# EasyEDA schematic SCH_AirQuality.json
TITLE: ESP8266 Air Quality Sensor; REV: 1.0; Date: 2025-07-12; Sheet: 1/1; Company: Your Company
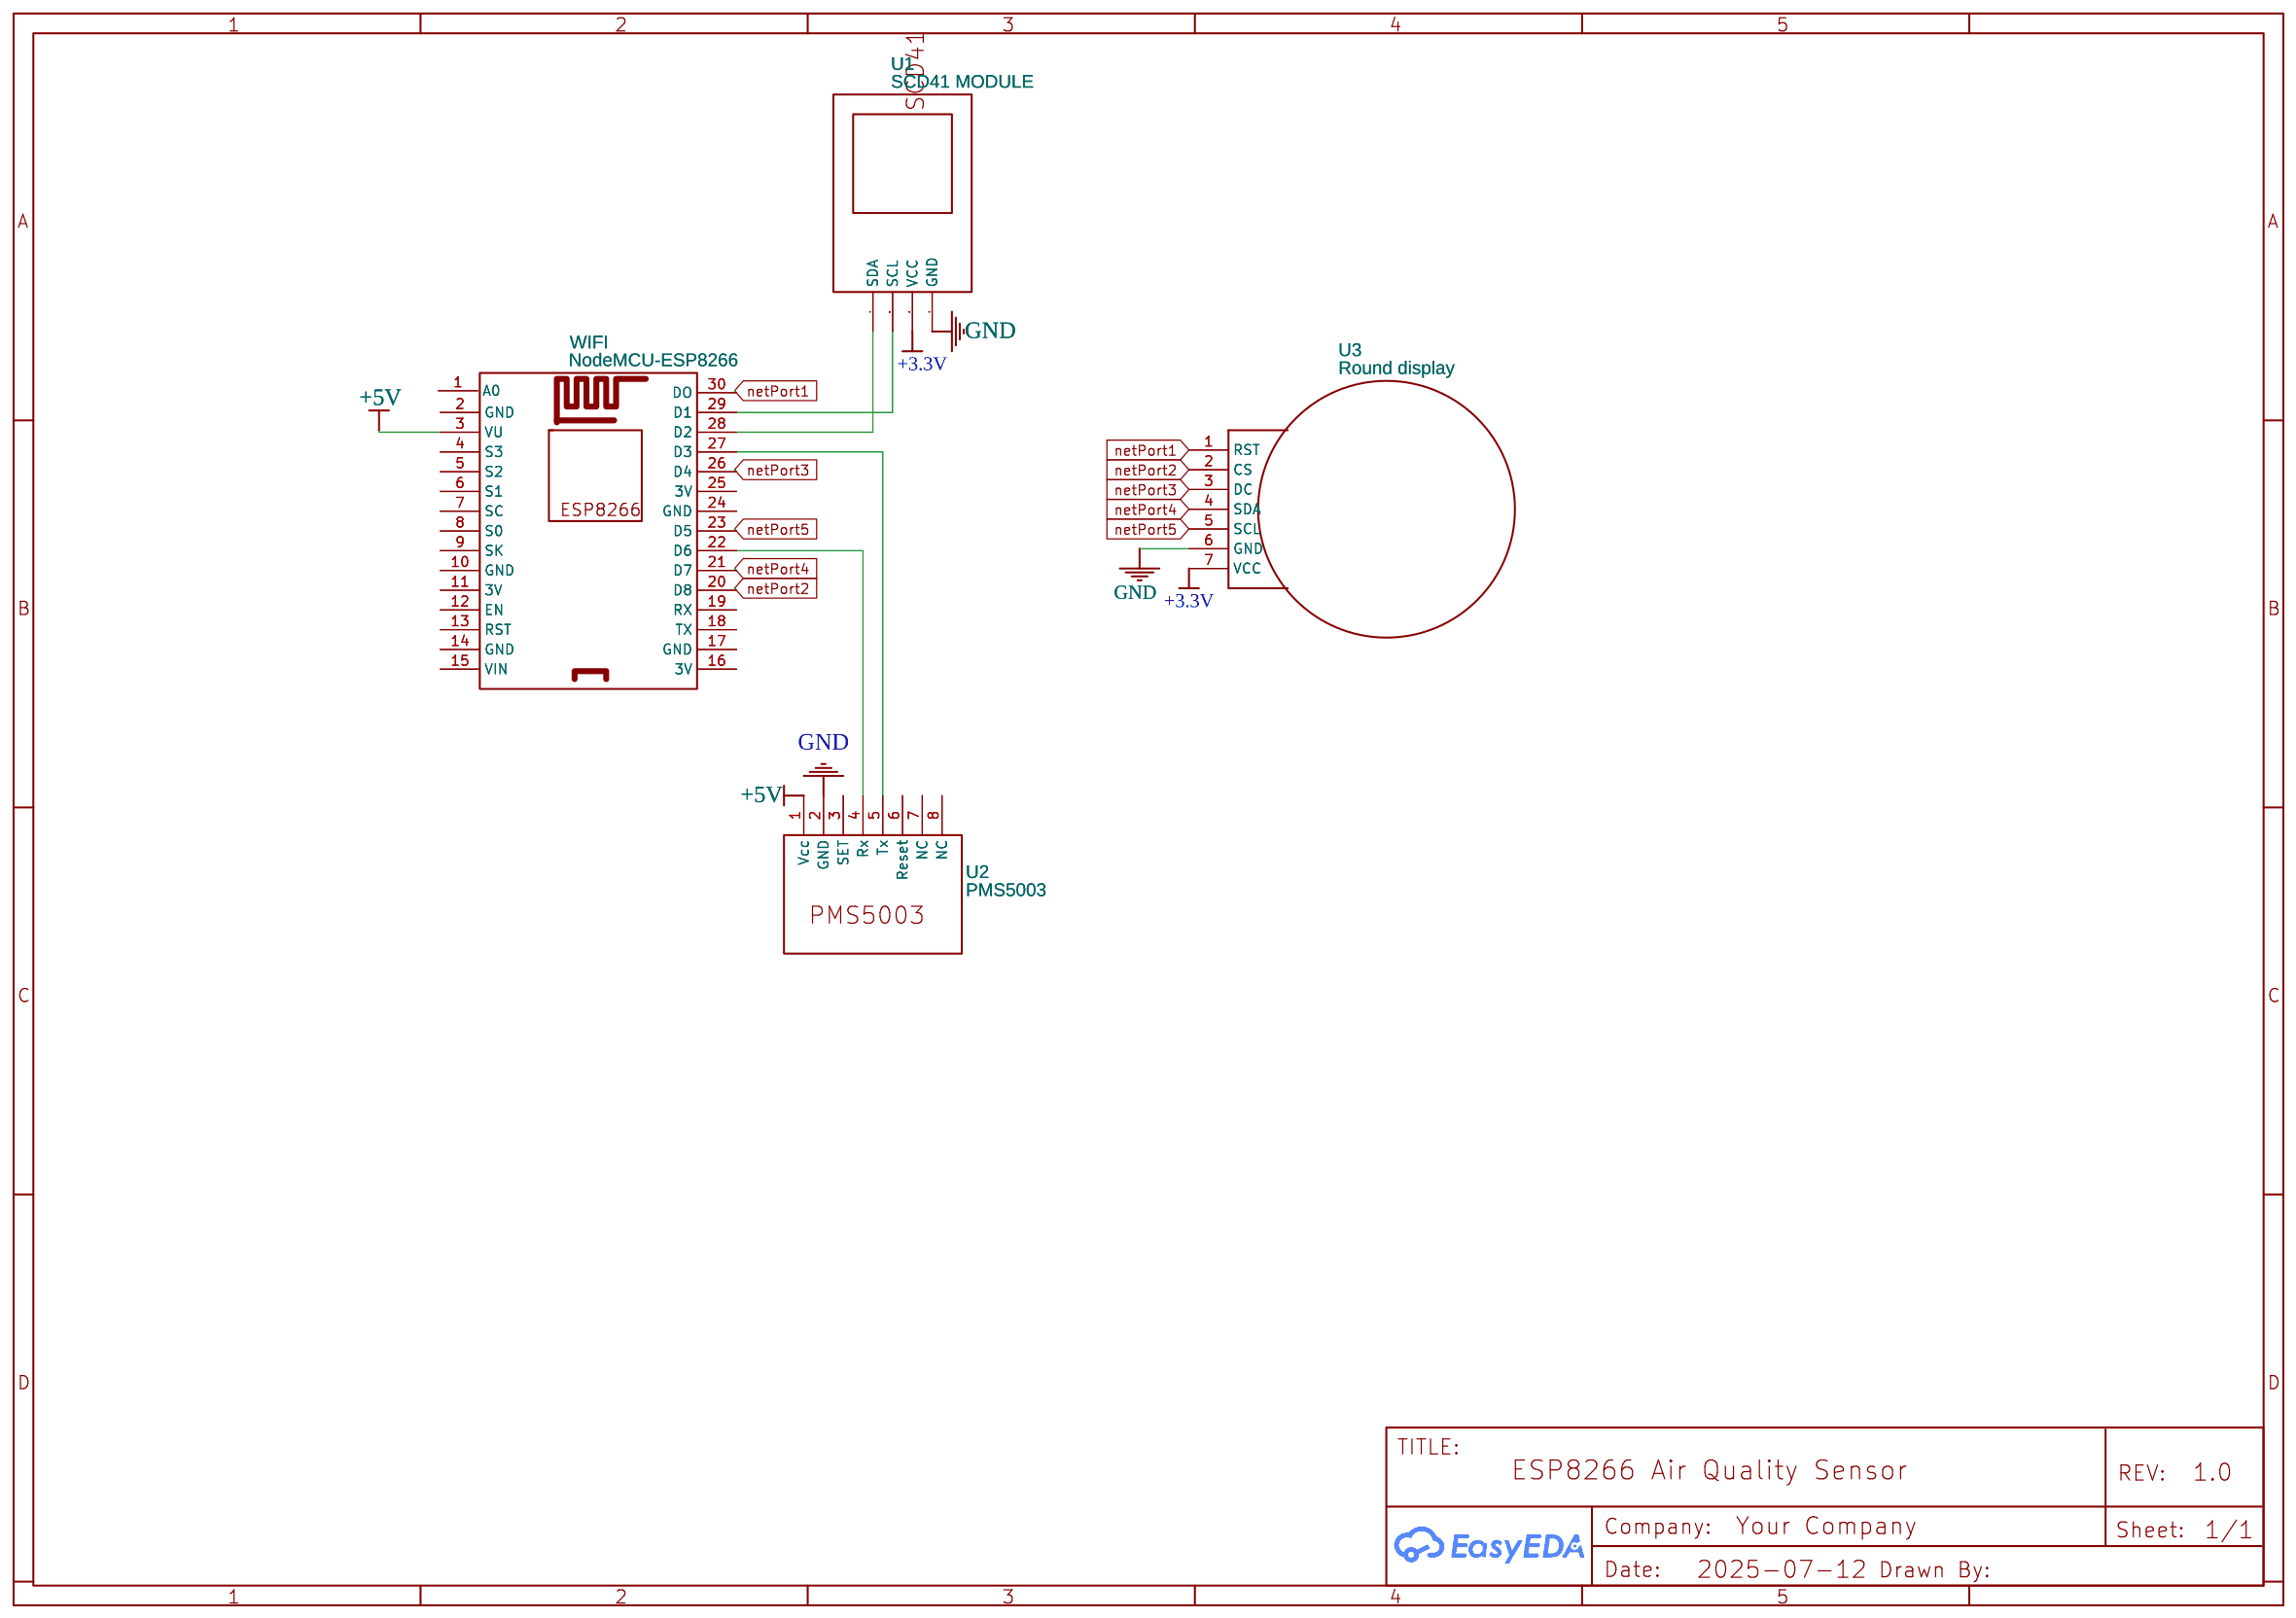
[diagram p0: schematic sheet]

## Parts
U1  SCD41 MODULE  [SCD41 MODULE]
U2  PMS5003  [PMS5003]
U3  Round display  [ROUND DISPLAY]
WIFI  NodeMCU-ESP8266  [LOLIN-ESP8266]

## Library data of the parts
U1 = SCD41 MODULE: Contributor: makeair4
U2 = PMS5003: Contributor: sanithuh
U3 = Round display: Supplier: Aliexpress; link: https://pl.aliexpress.com/item/1005004069703494.html?gatewayAdapt=glo2pol; Contributor: jakub.bartul
WIFI = NodeMCU-ESP8266: Manufacturer Part: NodeMCU-ESP8266 (S); link: www.NODEMCU.com; Contributor: sagarmalakanawar; Supplier: Lolin and Amica; subpart_no: 1

## Nets
+3.3V: U1.2(VCC) U3.7(VCC)
+5V: U2.1(Vcc) WIFI.3(VU)
GND: U1.1(GND) U2.2(GND) U3.6(GND)
netPort1: U3.1(RST) WIFI.30(DO)
netPort2: U3.2(CS) WIFI.20(D8)
netPort3: U3.3(DC) WIFI.26(D4)
netPort4: U3.4(SDA) WIFI.21(D7)
netPort5: U3.5(SCL) WIFI.23(D5)
Net-(U1-3): U1.3(SCL) WIFI.29(D1)
Net-(U1-4): U1.4(SDA) WIFI.28(D2)
Net-(U2-4): U2.4(Rx) WIFI.22(D6)
Net-(U2-5): U2.5(Tx) WIFI.27(D3)

Not connected (* = marked no-connect by the designer): U2 3(SET) 6(Reset) 7(NC) 8(NC); WIFI 1(A0) 2(GND) 4(S3) 5(S2) 6(S1) 7(SC) 8(S0) 9(SK) 10(GND) 11(3V) 12(EN) 13(RST) 14(GND) 15(VIN) 16(3V) 17(GND) 18(TX) 19(RX) 24(GND) 25(3V)
